# Altium schematic sheet top.SchDoc
size A4
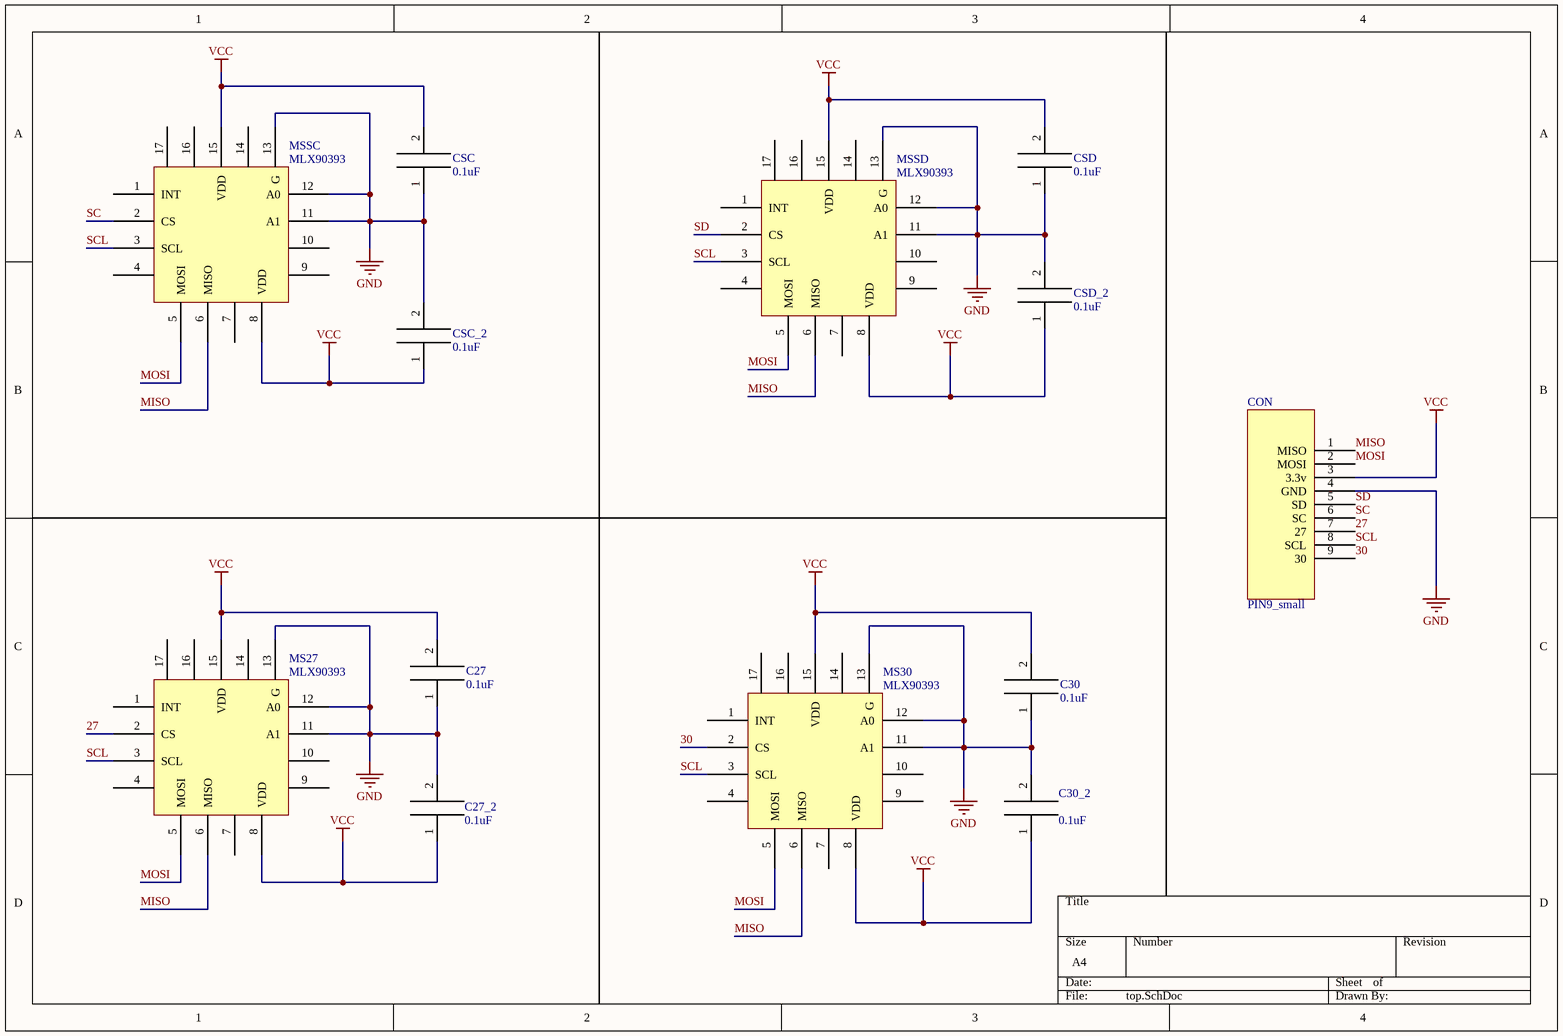
[diagram p0: top.SchDoc]

## Parts
C27  0.1uF  [CAP_0603]
C27_2  0.1uF  [CAP_0603]
C30  0.1uF  [CAP_0603]
C30_2  0.1uF  [CAP_0603]
CON  PIN9_small  [PIN9_small]
CSC  0.1uF  [CAP_0603]
CSC_2  0.1uF  [CAP_0603]
CSD  0.1uF  [CAP_0603]
CSD_2  0.1uF  [CAP_0603]
MS27  MLX90393  [MLX90393]
MS30  MLX90393  [MLX90393]
MSSC  MLX90393  [MLX90393]
MSSD  MLX90393  [MLX90393]

## Nets
GND: C27.1 C27_2.2 C30.1 C30_2.2 CON.4(GND) CSC.1 CSC_2.2 CSD.1 CSD_2.2 MS27.11(A1) MS27.12(A0) MS27.13(G) MS30.11(A1) MS30.12(A0) MS30.13(G) MSSC.11(A1) MSSC.12(A0) MSSC.13(G) MSSD.11(A1) MSSD.12(A0) MSSD.13(G)
VCC: C27.2 C27_2.1 C30.2 C30_2.1 CON.3(3.3v) CSC.2 CSC_2.1 CSD.2 CSD_2.1 MS27.8(VDD) MS27.15(VDD) MS30.8(VDD) MS30.15(VDD) MSSC.8(VDD) MSSC.15(VDD) MSSD.8(VDD) MSSD.15(VDD)
27: CON.7(27) MS27.2(CS)
30: CON.9(30) MS30.2(CS)
MISO: CON.1(MISO) MS27.6(MISO) MS30.6(MISO) MSSC.6(MISO) MSSD.6(MISO)
MOSI: CON.2(MOSI) MS27.5(MOSI) MS30.5(MOSI) MSSC.5(MOSI) MSSD.5(MOSI)
SC: CON.6(SC) MSSC.2(CS)
SCL: CON.8(SCL) MS27.3(SCL) MS30.3(SCL) MSSC.3(SCL) MSSD.3(SCL)
SD: CON.5(SD) MSSD.2(CS)

Not connected (* = marked no-connect by the designer): MS27 1(INT) 4 7 9 10 14 16 17; MS30 1(INT) 4 7 9 10 14 16 17; MSSC 1(INT) 4 7 9 10 14 16 17; MSSD 1(INT) 4 7 9 10 14 16 17

## Library data of the parts
C27 C27_2 C30 C30_2 CSC CSC_2 CSD CSD_2 = CAP: capacitance
MS27 MS30 MSSC MSSD = MLX90393: sensor